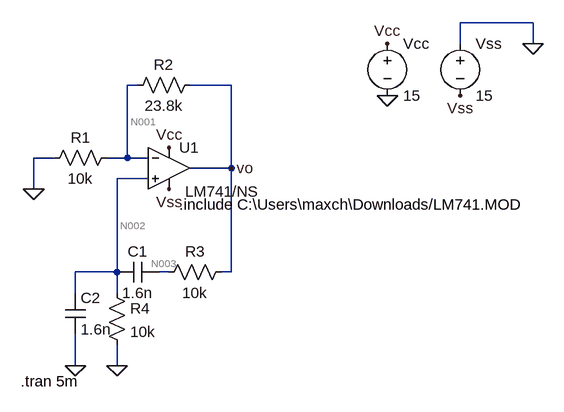
[diagram p0: schematic Oscillator.asc]
Oscillator.asc, the LTspice schematic file:
Version 4
SHEET 1 880 680
WIRE 560 -48 448 -48
WIRE 448 -16 448 -48
WIRE 560 -16 560 -48
WIRE -48 48 -64 48
WIRE 96 48 32 48
WIRE -176 160 -208 160
WIRE -64 160 -64 48
WIRE -64 160 -96 160
WIRE -32 160 -64 160
WIRE 96 176 96 48
WIRE 96 176 32 176
WIRE -32 192 -80 192
WIRE -208 208 -208 160
WIRE -80 336 -80 192
WIRE -80 336 -144 336
WIRE 0 336 -16 336
WIRE 96 336 96 176
WIRE 96 336 80 336
WIRE -144 368 -144 336
WIRE -80 368 -80 336
WIRE -144 480 -144 432
WIRE -80 480 -80 448
FLAG 336 64 0
FLAG 336 -16 Vcc
FLAG 0 144 Vcc
FLAG 0 208 Vss
FLAG -80 480 0
FLAG -144 480 0
FLAG -208 208 0
FLAG 96 176 vo
FLAG 560 -16 0
FLAG 448 64 Vss
SYMBOL Opamps\\opamp2 0 112 R0
WINDOW 3 25 100 Left 2
SYMATTR InstName U1
SYMATTR Value LM741/NS
SYMBOL voltage 336 -32 R0
WINDOW 123 0 0 Left 2
WINDOW 39 0 0 Left 2
SYMATTR InstName Vcc
SYMATTR Value 15
SYMBOL voltage 448 -32 R0
WINDOW 123 0 0 Left 2
WINDOW 39 0 0 Left 2
SYMATTR InstName Vss
SYMATTR Value 15
SYMBOL res -80 144 R90
WINDOW 0 0 56 VBottom 2
WINDOW 3 32 56 VTop 2
SYMATTR InstName R1
SYMATTR Value 10k
SYMBOL res 48 32 R90
WINDOW 0 0 56 VBottom 2
WINDOW 3 32 56 VTop 2
SYMATTR InstName R2
SYMATTR Value 23.8k
SYMBOL res 96 320 R90
WINDOW 0 0 56 VBottom 2
WINDOW 3 32 56 VTop 2
SYMATTR InstName R3
SYMATTR Value 10k
SYMBOL cap -16 320 R90
WINDOW 0 0 32 VBottom 2
WINDOW 3 32 32 VTop 2
SYMATTR InstName C1
SYMATTR Value 1.6n
SYMBOL res -96 352 R0
SYMATTR InstName R4
SYMATTR Value 10k
SYMBOL cap -160 368 R0
SYMATTR InstName C2
SYMATTR Value 1.6n
TEXT 16 232 Left 2 !.include C:\\Users\\maxch\\Downloads/LM741.MOD
TEXT -228 504 Left 2 !.tran 5m

The netlist it stands for:
* Oscillator.asc
XU1 N002 N001 Vcc Vss vo LM741/NS  ; pins In+ In- V+ V- OUT
Vcc Vcc 0 15
Vss 0 Vss 15
R1 N001 0 10k
R2 vo N001 23.8k
R3 vo N003 10k
C1 N003 N002 1.6n
R4 N002 0 10k
C2 N002 0 1.6n
.include C:\Users\maxch\Downloads/LM741.MOD
.tran 5m
.backanno
.end

* Results of the author's LTspice run, read from the files saved beside the schematic
* Operating Point, zero values left out:
*   V(n001) = 421.4 µV
*   V(n002) = -578.6 µV
*   V(vss) = -15 V
*   V(vcc) = 15 V
*   V(vo) = 3.849 mV
*   V(n003) = 3.849 mV
*   I(R4) = -57.86 nA
*   I(R2) = 144 nA
*   I(R1) = 42.14 nA
*   I(Vss) = -1.701 mA
*   I(Vcc) = -1.701 mA
*   Ix(u1:1) = 57.86 nA
*   Ix(u1:2) = 101.9 nA
*   Ix(u1:99) = 1.701 mA
*   Ix(u1:50) = -1.701 mA
*   Ix(u1:28) = -144 nA
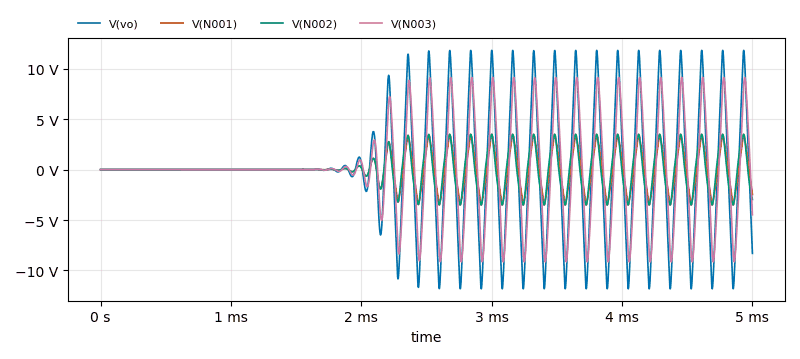
[diagram p1: Transient Analysis of Oscillator.asc, plotted from the saved traces]
* Transient Analysis, 1 run:
*   V(vo): min -11.81 V, max 11.82 V, average 34.81 mV, rms 5.539 V, last -8.305 V
*   V(N001): min -3.496 V, max 3.497 V, average 9.519 mV, rms 1.639 V, last -2.465 V
*   V(N002): min -3.499 V, max 3.498 V, average 4.216 mV, rms 1.745 V, last -2.964 V
*   V(N003): min -9.148 V, max 9.16 V, average 39.6 mV, rms 4.474 V, last -4.485 V